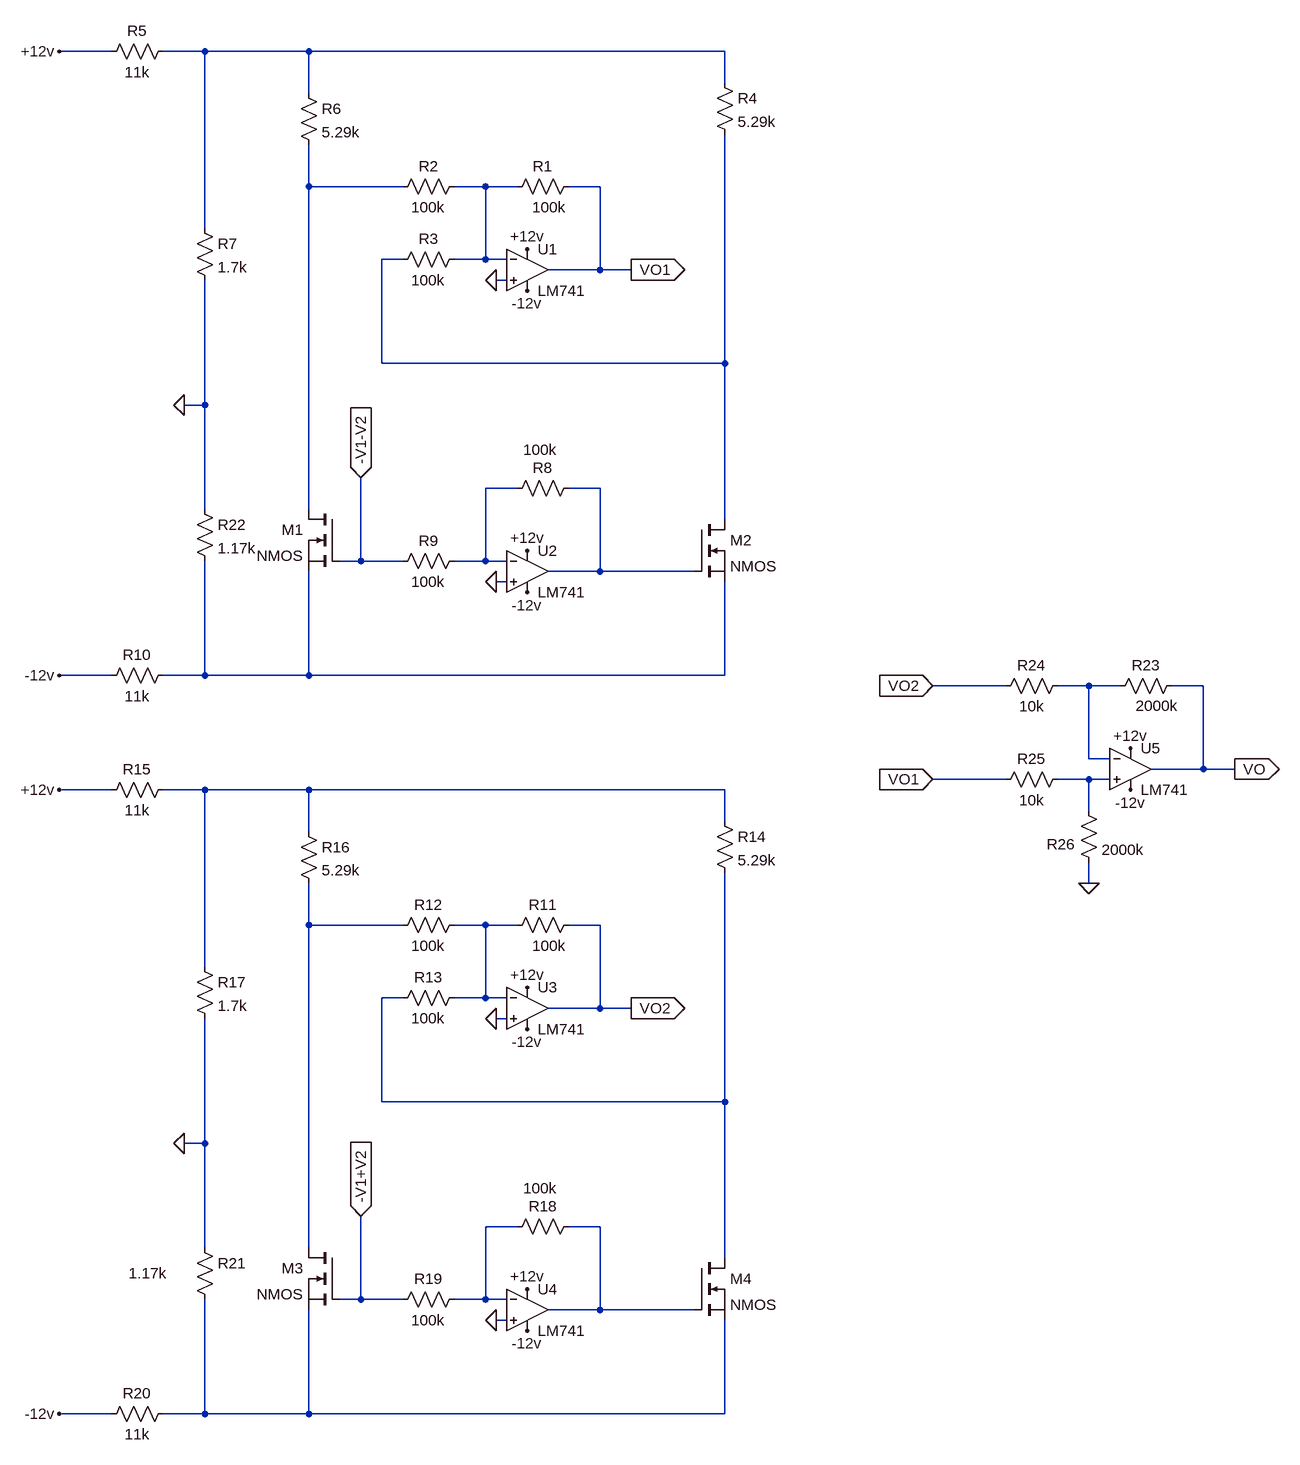
[diagram p0: schematic Draft1.asc]
Draft1.asc, the LTspice schematic file:
Version 4
SHEET 1 1308 1020
WIRE -512 -1136 -592 -1136
WIRE -368 -1136 -432 -1136
WIRE -208 -1136 -368 -1136
WIRE 432 -1136 -208 -1136
WIRE 432 -1088 432 -1136
WIRE -208 -1072 -208 -1136
WIRE -208 -928 -208 -992
WIRE -64 -928 -208 -928
WIRE 64 -928 16 -928
WIRE 112 -928 64 -928
WIRE 240 -928 192 -928
WIRE -368 -864 -368 -1136
WIRE -64 -816 -96 -816
WIRE 64 -816 64 -928
WIRE 64 -816 16 -816
WIRE 96 -816 64 -816
WIRE 240 -800 240 -928
WIRE 240 -800 160 -800
WIRE 288 -800 240 -800
WIRE 96 -784 80 -784
WIRE -96 -656 -96 -816
WIRE 432 -656 432 -1008
WIRE 432 -656 -96 -656
WIRE -368 -592 -368 -784
WIRE -368 -592 -400 -592
WIRE 112 -464 64 -464
WIRE 240 -464 192 -464
WIRE -368 -432 -368 -592
WIRE -208 -432 -208 -928
WIRE 432 -416 432 -656
WIRE -128 -352 -128 -480
WIRE -128 -352 -160 -352
WIRE -64 -352 -128 -352
WIRE 64 -352 64 -464
WIRE 64 -352 16 -352
WIRE 96 -352 64 -352
WIRE 240 -336 240 -464
WIRE 240 -336 160 -336
WIRE 384 -336 240 -336
WIRE 96 -320 80 -320
WIRE -512 -176 -592 -176
WIRE -368 -176 -368 -352
WIRE -368 -176 -432 -176
WIRE -208 -176 -208 -336
WIRE -208 -176 -368 -176
WIRE 432 -176 432 -320
WIRE 432 -176 -208 -176
WIRE 864 -160 752 -160
WIRE 992 -160 944 -160
WIRE 1040 -160 992 -160
WIRE 1168 -160 1120 -160
WIRE 992 -48 992 -160
WIRE 1024 -48 992 -48
WIRE 1168 -32 1168 -160
WIRE 1168 -32 1088 -32
WIRE 1216 -32 1168 -32
WIRE 864 -16 752 -16
WIRE 992 -16 944 -16
WIRE 1024 -16 992 -16
WIRE -512 0 -592 0
WIRE -368 0 -432 0
WIRE -208 0 -368 0
WIRE 432 0 -208 0
WIRE 992 32 992 -16
WIRE 432 48 432 0
WIRE -208 64 -208 0
WIRE 992 144 992 112
WIRE -208 208 -208 144
WIRE -64 208 -208 208
WIRE 64 208 16 208
WIRE 112 208 64 208
WIRE 240 208 192 208
WIRE -368 272 -368 0
WIRE -64 320 -96 320
WIRE 64 320 64 208
WIRE 64 320 16 320
WIRE 96 320 64 320
WIRE 240 336 240 208
WIRE 240 336 160 336
WIRE 288 336 240 336
WIRE 96 352 80 352
WIRE -96 480 -96 320
WIRE 432 480 432 128
WIRE 432 480 -96 480
WIRE -368 544 -368 352
WIRE -368 544 -400 544
WIRE 112 672 64 672
WIRE 240 672 192 672
WIRE -368 704 -368 544
WIRE -208 704 -208 208
WIRE 432 720 432 480
WIRE -128 784 -128 656
WIRE -128 784 -160 784
WIRE -64 784 -128 784
WIRE 64 784 64 672
WIRE 64 784 16 784
WIRE 96 784 64 784
WIRE 240 800 240 672
WIRE 240 800 160 800
WIRE 384 800 240 800
WIRE 96 816 80 816
WIRE -512 960 -592 960
WIRE -368 960 -368 784
WIRE -368 960 -432 960
WIRE -208 960 -208 800
WIRE -208 960 -368 960
WIRE 432 960 432 816
WIRE 432 960 -208 960
FLAG 80 -784 0
FLAG 128 -832 +12v
FLAG 128 -768 -12v
FLAG 80 -320 0
FLAG 128 -368 +12v
FLAG 128 -304 -12v
FLAG 288 -800 VO1
IOPIN 288 -800 Out
FLAG -400 -592 0
FLAG -592 -176 -12v
FLAG -592 -1136 +12v
FLAG -128 -480 -V1-V2
IOPIN -128 -480 In
FLAG 80 352 0
FLAG 128 304 +12v
FLAG 128 368 -12v
FLAG 80 816 0
FLAG 128 768 +12v
FLAG 128 832 -12v
FLAG 288 336 VO2
IOPIN 288 336 Out
FLAG -400 544 0
FLAG -592 960 -12v
FLAG -592 0 +12v
FLAG -128 656 -V1+V2
IOPIN -128 656 In
FLAG 752 -160 VO2
IOPIN 752 -160 In
FLAG 752 -16 VO1
IOPIN 752 -16 In
FLAG 1056 -64 +12v
FLAG 1056 0 -12v
FLAG 992 144 0
FLAG 1216 -32 VO
IOPIN 1216 -32 Out
SYMBOL OpAmps\\LM741 128 -864 R0
SYMATTR InstName U1
SYMBOL res 208 -944 R90
WINDOW 0 0 56 VBottom 2
WINDOW 3 32 46 VTop 2
SYMATTR InstName R1
SYMATTR Value 100k
SYMBOL res 32 -944 R90
WINDOW 0 0 56 VBottom 2
WINDOW 3 32 56 VTop 2
SYMATTR InstName R2
SYMATTR Value 100k
SYMBOL res 32 -832 R90
WINDOW 0 0 56 VBottom 2
WINDOW 3 32 56 VTop 2
SYMATTR InstName R3
SYMATTR Value 100k
SYMBOL res 416 -1104 R0
SYMATTR InstName R4
SYMATTR Value 5.29k
SYMBOL res -416 -1152 R90
WINDOW 0 0 56 VBottom 2
WINDOW 3 32 56 VTop 2
SYMATTR InstName R5
SYMATTR Value 11k
SYMBOL res -224 -1088 R0
SYMATTR InstName R6
SYMATTR Value 5.29k
SYMBOL res -384 -880 R0
SYMATTR InstName R7
SYMATTR Value 1.7k
SYMBOL OpAmps\\LM741 128 -400 R0
SYMATTR InstName U2
SYMBOL res 208 -480 R90
WINDOW 0 0 56 VBottom 2
WINDOW 3 -59 60 VTop 2
SYMATTR InstName R8
SYMATTR Value 100k
SYMBOL res 32 -368 R90
WINDOW 0 0 56 VBottom 2
WINDOW 3 32 56 VTop 2
SYMATTR InstName R9
SYMATTR Value 100k
SYMBOL nmos -160 -432 M0
SYMATTR InstName M1
SYMBOL nmos 384 -416 R0
SYMATTR InstName M2
SYMBOL res -416 -192 R90
WINDOW 0 0 56 VBottom 2
WINDOW 3 32 56 VTop 2
SYMATTR InstName R10
SYMATTR Value 11k
SYMBOL OpAmps\\LM741 128 272 R0
SYMATTR InstName U3
SYMBOL res 208 192 R90
WINDOW 0 0 56 VBottom 2
WINDOW 3 32 46 VTop 2
SYMATTR InstName R11
SYMATTR Value 100k
SYMBOL res 32 192 R90
WINDOW 0 0 56 VBottom 2
WINDOW 3 32 56 VTop 2
SYMATTR InstName R12
SYMATTR Value 100k
SYMBOL res 32 304 R90
WINDOW 0 0 56 VBottom 2
WINDOW 3 32 56 VTop 2
SYMATTR InstName R13
SYMATTR Value 100k
SYMBOL res 416 32 R0
SYMATTR InstName R14
SYMATTR Value 5.29k
SYMBOL res -416 -16 R90
WINDOW 0 0 56 VBottom 2
WINDOW 3 32 56 VTop 2
SYMATTR InstName R15
SYMATTR Value 11k
SYMBOL res -224 48 R0
SYMATTR InstName R16
SYMATTR Value 5.29k
SYMBOL res -384 256 R0
SYMATTR InstName R17
SYMATTR Value 1.7k
SYMBOL OpAmps\\LM741 128 736 R0
SYMATTR InstName U4
SYMBOL res 208 656 R90
WINDOW 0 0 56 VBottom 2
WINDOW 3 -59 60 VTop 2
SYMATTR InstName R18
SYMATTR Value 100k
SYMBOL res 32 768 R90
WINDOW 0 0 56 VBottom 2
WINDOW 3 32 56 VTop 2
SYMATTR InstName R19
SYMATTR Value 100k
SYMBOL nmos -160 704 M0
SYMATTR InstName M3
SYMBOL nmos 384 720 R0
SYMATTR InstName M4
SYMBOL res -416 944 R90
WINDOW 0 0 56 VBottom 2
WINDOW 3 32 56 VTop 2
SYMATTR InstName R20
SYMATTR Value 11k
SYMBOL res -384 688 R0
WINDOW 3 -101 56 Left 2
SYMATTR Value 1.17k
SYMATTR InstName R21
SYMBOL res -384 -448 R0
SYMATTR InstName R22
SYMATTR Value 1.17k
SYMBOL OpAmps\\LM741 1056 -96 R0
SYMATTR InstName U5
SYMBOL res 1136 -176 R90
WINDOW 0 0 56 VBottom 2
WINDOW 3 31 39 VTop 2
SYMATTR InstName R23
SYMATTR Value 2000k
SYMBOL res 960 -176 R90
WINDOW 0 0 56 VBottom 2
WINDOW 3 32 56 VTop 2
SYMATTR InstName R24
SYMATTR Value 10k
SYMBOL res 960 -32 R90
WINDOW 0 0 56 VBottom 2
WINDOW 3 32 56 VTop 2
SYMATTR InstName R25
SYMATTR Value 10k
SYMBOL res 976 16 R0
WINDOW 0 -49 68 Left 2
SYMATTR InstName R26
SYMATTR Value 2000k

The netlist it stands for:
* Draft1.asc
XU1 0 N003 +12v -12v VO1 LM741  ; pins In+ In- V+ V- OUT
R1 VO1 N003 100k
R2 N003 N002 100k
R3 N003 N004 100k
R4 N001 N004 5.29k
R5 N001 +12v 11k
R6 N001 N002 5.29k
R7 N001 0 1.7k
XU2 0 N005 +12v -12v N006 LM741  ; pins In+ In- V+ V- OUT
R8 N006 N005 100k
R9 N005 -V1-V2 100k
M1 N002 -V1-V2 N007 N007 NMOS
M2 N004 N006 N007 N007 NMOS
R10 N007 -12v 11k
XU3 0 N012 +12v -12v VO2 LM741  ; pins In+ In- V+ V- OUT
R11 VO2 N012 100k
R12 N012 N011 100k
R13 N012 N013 100k
R14 N010 N013 5.29k
R15 N010 +12v 11k
R16 N010 N011 5.29k
R17 N010 0 1.7k
XU4 0 N014 +12v -12v N015 LM741  ; pins In+ In- V+ V- OUT
R18 N015 N014 100k
R19 N014 -V1+V2 100k
M3 N011 -V1+V2 N016 N016 NMOS
M4 N013 N015 N016 N016 NMOS
R20 N016 -12v 11k
R21 0 N016 1.17k
R22 0 N007 1.17k
XU5 N009 N008 +12v -12v VO LM741  ; pins In+ In- V+ V- OUT
R23 VO N008 2000k
R24 N008 VO2 10k
R25 N009 VO1 10k
R26 N009 0 2000k
.model NMOS NMOS
.model PMOS PMOS
.lib standard.mos
.lib LM741.lib
.backanno
.end